# EAGLE schematic raspi-shield (EAGLE 9.2.0)
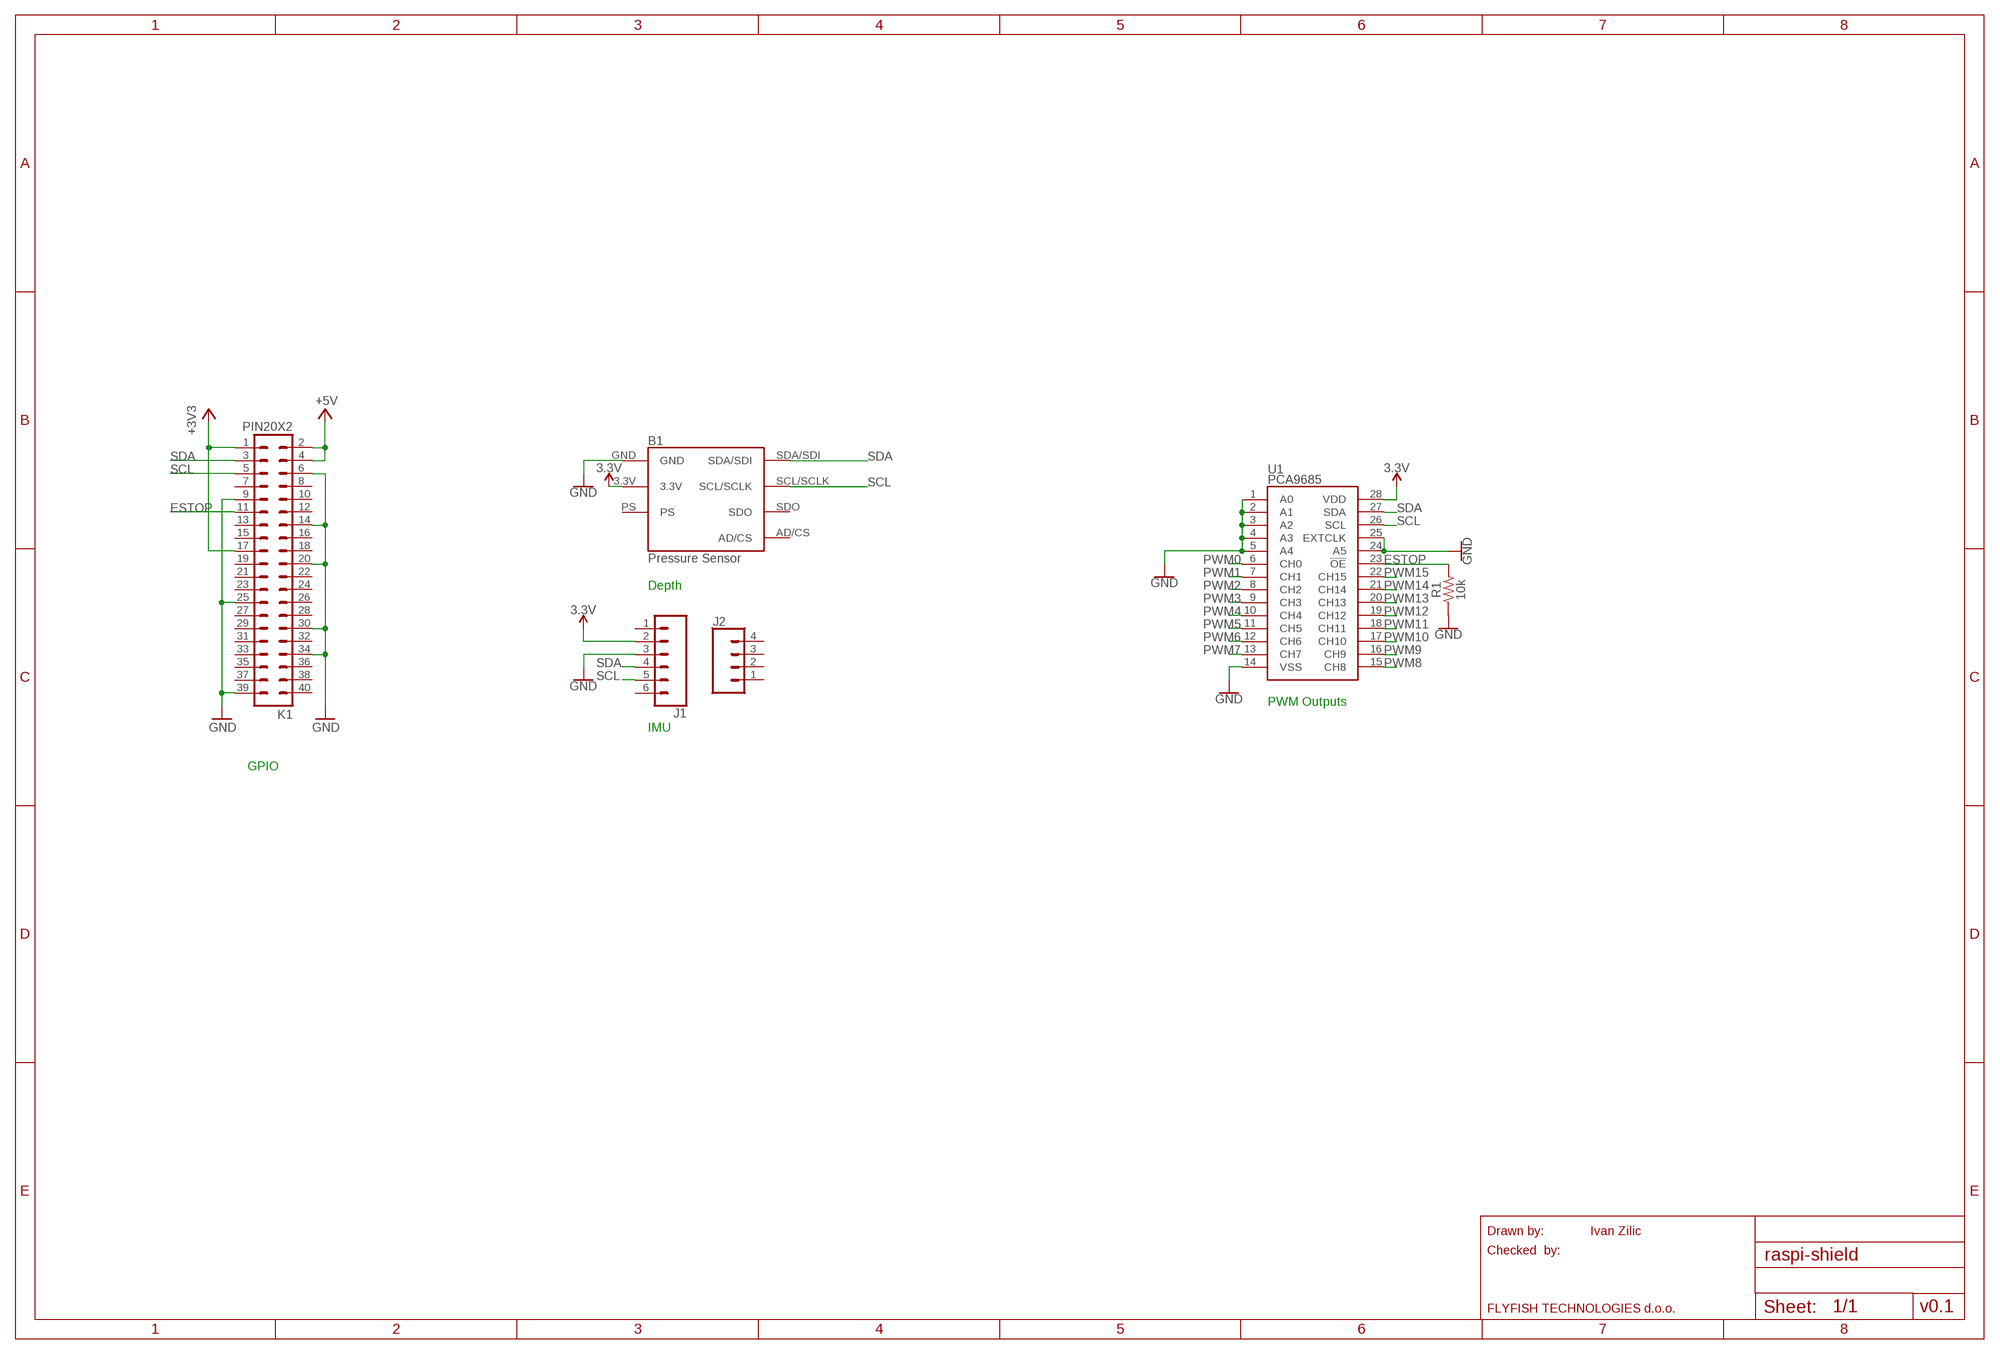
[diagram p0: schematic, sheet 1]

## Parts
B1  Pressure Sensor  SPARKFUN_MS5803-14BA_BREAKOUT  [SPARKFUN_MS5803-14BA_BREAKOUT]
J1  CONN_06NO_SILK_FEMALE_PTH  [1X06_NO_SILK]
J2  CONN_041X04_NO_SILK  [1X04_NO_SILK]
K1  PIN20X2  [PIN_20X2]
R1  10k  10KOHM-0603-1/10W-1%  [0603]
U1  PCA9685  [TSSOP-28_4MM]

## Nets
3.3V: B1.3.3V J1.2 U1.28(VDD)
+3V3: K1.1 K1.17
+5V: K1.2 K1.4
ESTOP: K1.11 R1.2 U1.23(!OE)
GND: B1.GND J1.3 K1.6 K1.9 K1.14 K1.20 K1.25 K1.30 K1.34 K1.39 R1.1 U1.1(A0) U1.2(A1) U1.3(A2) U1.4(A3) U1.5(A4) U1.14(VSS) U1.24(A5) U1.25(EXTCLK)
PWM0: U1.6(CH0)
PWM1: U1.7(CH1)
PWM2: U1.8(CH2)
PWM3: U1.9(CH3)
PWM4: U1.10(CH4)
PWM5: U1.11(CH5)
PWM6: U1.12(CH6)
PWM7: U1.13(CH7)
PWM8: U1.15(CH8)
PWM9: U1.16(CH9)
PWM10: U1.17(CH10)
PWM11: U1.18(CH11)
PWM12: U1.19(CH12)
PWM13: U1.20(CH13)
PWM14: U1.21(CH14)
PWM15: U1.22(CH15)
SCL: B1.SCL/SCLK J1.5 K1.5 U1.26(SCL)
SDA: B1.SDA/SDI J1.4 K1.3 U1.27(SDA)
Unconnected: B1.AD/CS B1.PS B1.SDO J1.1 J1.6 J2.1 J2.2 J2.3 J2.4 K1.7 K1.8 K1.10 K1.12 K1.13 K1.15 K1.16 K1.18 K1.19 K1.21 K1.22 K1.23 K1.24 K1.26 K1.27 K1.28 K1.29 K1.31 K1.32 K1.33 K1.35 K1.36 K1.37 K1.38 K1.40

## Notes on the sheet
- Depth
- PWM Outputs
- IMU
- GPIO
- Drawn by: | Ivan Zilic
- Checked  by:
- FLYFISH TECHNOLOGIES d.o.o. | v0.1

## Library data of the parts
B1 = SparkFun-Boards:SPARKFUN_MS5803-14BA_BREAKOUT: SparkFun MSP5803-14BA Breakout I2C compatible pressure sensor breakout SparkFun Products: SparkFun MSP5803-14BA Breakout <https://www.sparkfun.com/products/12909>; SF_ID: SEN-12909
J1 = SparkFun-Connectors:CONN_06: Multi connection point. Often used as Generic Header-pin footprint for 0.1 inch spaced/style header connections On any of the 0.1 inch spaced packages, you can populate with these: Break Away Headers - Straight <https://www.sparkfun.com/products/116> (PRT-00116) Break Away Male Headers - Right Angle <https://www.sparkfun.com/products/553> (PRT-00553) Female Headers <https://www.sparkfun.com/products/115> (PRT-00115) Break Away Headers - Machine Pin <https://www.sparkfun.com/products/117> (PRT-00117) Break Away Female Headers - Swiss Machine Pin <https://www.sparkfun.com/products/743> (PRT-00743) Arduino Stackable Header - 6 Pin <https://www.sparkfun.com/products/9280> (PRT-09280) For SCREWTERMINALS and SPRING TERMINALS visit here: Screw Terimnals on SparkFun.com <https://www.sparkfun.com/search/results?term=Screw+Terminals> (5mm/3.5mm/2.54mm spacing) This device is also useful as a general connection point to wire up your design to another part of your project. Our various solder wires solder well into these plated through hole pads. Hook-Up Wire - Assortment (Stranded, 22 AWG) <https://www.sparkfun.com/products/11375> (PRT-11375) Hook-Up Wire - Assortment (Solid Core, 22 AWG) <https://www.sparkfun.com/products/11367> (PRT-11367) View the entire wire category on our website here <https://www.sparkfun.com/categories/141>; PROD_ID: CONN-08437
J2 = SparkFun-Connectors:CONN_04: Multi connection point. Often used as Generic Header-pin footprint for 0.1 inch spaced/style header connections On any of the 0.1 inch spaced packages, you can populate with these: Break Away Headers - Straight <https://www.sparkfun.com/products/116> (PRT-00116) Break Away Male Headers - Right Angle <https://www.sparkfun.com/products/553> (PRT-00553) Female Headers <https://www.sparkfun.com/products/115> (PRT-00115) Break Away Headers - Machine Pin <https://www.sparkfun.com/products/117> (PRT-00117) Break Away Female Headers - Swiss Machine Pin <https://www.sparkfun.com/products/743> (PRT-00743) For SCREWTERMINALS and SPRING TERMINALS visit here: Screw Terimnals on SparkFun.com <https://www.sparkfun.com/search/results?term=Screw+Terminals> (5mm/3.5mm/2.54mm spacing) This device is also useful as a general connection point to wire up your design to another part of your project. Our various solder wires solder well into these plated through hole pads. Hook-Up Wire - Assortment (Stranded, 22 AWG) <https://www.sparkfun.com/products/11375> (PRT-11375) Hook-Up Wire - Assortment (Solid Core, 22 AWG) <https://www.sparkfun.com/products/11367> (PRT-11367) View the entire wire category on our website here <https://www.sparkfun.com/categories/141> Special notes: Molex polarized connector foot print use with SKU : PRT-08231 with associated crimp pins and housings. 1MM SMD Version SKU: PRT-10208; PROD_ID: CONN-09696
K1 = FLYFISH:PIN20X2
R1 = SparkFun-Resistors:10KOHM: 10kΩ resistor A resistor is a passive two-terminal electrical component that implements electrical resistance as a circuit element. Resistors act to reduce current flow, and, at the same time, act to lower voltage levels within circuits. - Wikipedia; PROD_ID: RES-00824
U1 = SparkFun-IC-Special-Function:PCA9685: 16-channel 12-bit PWM I2C interface Internal Oscillator 40Hz to 1kHz Can be totem pole or open collector 2.3V to 5.5V SparkFun Products SparkFun Block for Intel® Edison - PWM <https://www.sparkfun.com/products/13042> (DEV-13042) PROTO: IC-12240 PROD_ID: IC-12271; PROD_ID: IC-12271